# Altium project controller pico.PrjPcb
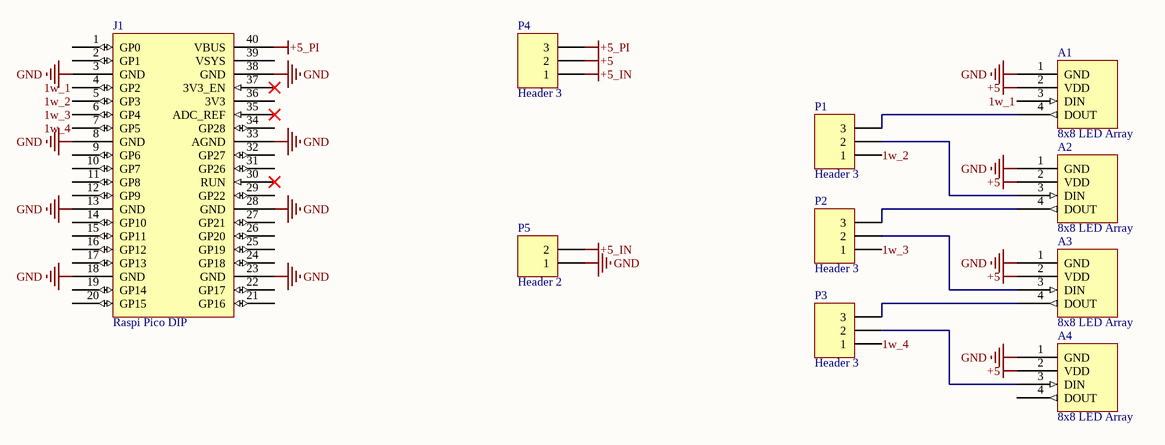
[diagram p0: main.SchDoc]
1 sheet, 10 parts. Net scope: strictly hierarchical (ports join the sheet entries above them; power ports are local).
Board file: main.PcbDoc

## Sheet main.SchDoc
size A4; SheetNumber: 1; SheetTotal: 1

### Parts
A1  8x8 LED Array  [12x12 SK6805 Matrix]
A2  8x8 LED Array  [12x12 SK6805 Matrix]
A3  8x8 LED Array  [12x12 SK6805 Matrix]
A4  8x8 LED Array  [12x12 SK6805 Matrix]
J1  Raspi Pico DIP  [Raspi Pico DIP]
P1  Header 3  [HDR1X3]
P2  Header 3  [HDR1X3]
P3  Header 3  [HDR1X3]
P4  Header 3  [HDR1X3]
P5  Header 2  [HDR1X2]

### Nets
+5: A1.2(VDD) A2.2(VDD) A3.2(VDD) A4.2(VDD) P4.2
+5_IN: P4.1 P5.2
+5_PI: J1.40(VBUS) P4.3
GND: A1.1(GND) A2.1(GND) A3.1(GND) A4.1(GND) J1.3(GND) J1.8(GND) J1.13(GND) J1.18(GND) J1.23(GND) J1.28(GND) J1.33(AGND) J1.38(GND) P5.1
1w_1: A1.3(DIN) J1.4(GP2)
1w_2: J1.5(GP3) P1.1
1w_3: J1.6(GP4) P2.1
1w_4: J1.7(GP5) P3.1
NetA1_4: A1.4(DOUT) P1.3
NetA2_3: A2.3(DIN) P1.2
NetA2_4: A2.4(DOUT) P2.3
NetA3_3: A3.3(DIN) P2.2
NetA3_4: A3.4(DOUT) P3.3
NetA4_3: A4.3(DIN) P3.2

Not connected (* = marked no-connect by the designer): A4 4(DOUT); J1 1(GP0) 2(GP1) 9(GP6) 10(GP7) 11(GP8) 12(GP9) 14(GP10) 15(GP11) 16(GP12) 17(GP13) 19(GP14) 20(GP15) 21(GP16) 22(GP17) 24(GP18) 25(GP19) 26(GP20) 27(GP21) 29(GP22) 30(RUN)* 31(GP26) 32(GP27) 34(GP28) 35(ADC_REF)* 36(3V3) 37(3V3_EN)* 39(VSYS)

### Library data of the parts
A1-A4 = 12x12 SK6805 Array
P1-P4 = Header 3: Header, 3-Pin; LatestRevisionDate: 17-Jul-2002; LatestRevisionNote: Re-released for DXP Platform.; Publisher: Altium Limited
P5 = Header 2: Header, 2-Pin; LatestRevisionDate: 17-Jul-2002; LatestRevisionNote: Re-released for DXP Platform.; Publisher: Altium Limited